# Altium schematic sheet INA219_Rsense.SchDoc
size A4; SheetNumber: 2; SheetTotal: 2
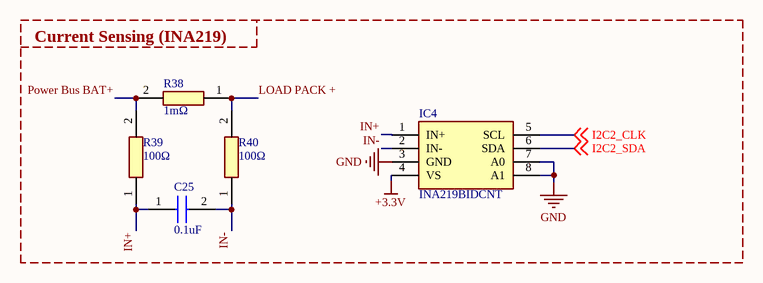
[diagram p0: INA219_Rsense.SchDoc]

## Parts
C25  0.1uF  [CAPC3216X180N]
IC4  INA219BIDCNT  [SOT65P280X145-8N]
R38  1mΩ  [RESC1608X55N]
R39  100Ω  [RESC1608X55N]
R40  100Ω  [RESC1608X55N]

## Blocks framed on the sheet
Current Sensing (INA219): C25 IC4 R38-R40

## Nets
+3.3V: IC4.4(VS)
GND: IC4.3(GND) IC4.7(A0) IC4.8(A1)
I2C2_CLK: IC4.5(SCL) ; off-sheet I2C2_CLK
I2C2_SDA: IC4.6(SDA) ; off-sheet I2C2_SDA
IN+: C25.1 IC4.1(IN+) R39.1
IN-: C25.2 IC4.2(IN-) R40.1
LOAD PACK +: R38.1 R40.2
Power Bus BAT+: R38.2 R39.2

## Notes on the sheet
- (near IC4) INA219 High Side DC Current Sensor Breakout Board - 26V ± 3.2A Max Specifications
  0.1 ohm 1% 2W current sensing resistance
  Target voltage up to + 26V
  Current measurement up to ± 3.2A with ± 0.8mA resolution
  0,9 "x 0,8" PCB
  PCB (excluding header or terminal block): 1.9g
  Note: The terminal block supplied with your product may be blue or black.
  This board / chip uses I2C 7 bit addresses 0x40, 0x41, 0x44, 0x45, which can be selected with jumper wires.

## Library data of the parts
C25 = GRM31CD80J107MEA8L: Capacitor; Manufacturer_Name: Murata Electronics; Height: 1.8mm; Manufacturer_Part_Number: GRM31CD80J107MEA8L; Mouser Part Number: 81-GRM31CD80J107MA8L; Mouser Price/Stock: https://www.mouser.co.uk/ProductDetail/Murata-Electronics/GRM31CD80J107MEA8L?qs=DPoM0jnrROWnWfPYsqocbw%3D%3D
IC4 = INA219BIDCNT: Integrated Circuit; Manufacturer_Name: Texas Instruments; Datasheet Link: http://www.ti.com/lit/ds/symlink/ina219.pdf; Height: 1.45mm; Manufacturer_Part_Number: INA219BIDCNT; Mouser Part Number: 595-INA219BIDCNT; Mouser Price/Stock: https://www.mouser.co.uk/ProductDetail/Texas-Instruments/INA219BIDCNT?qs=1WmUhT%2FVMIMmEKxVjzYikA%3D%3D; Arrow Part Number: INA219BIDCNT; Arrow Price/Stock: https://www.arrow.com/en/products/ina219bidcnt/texas-instruments?region=nac
R38-R40 = CRG0603F470R: Resistor; Manufacturer_Name: TE Connectivity; Datasheet Link: https://datasheet.datasheetarchive.com/originals/distributors/DKDS-21/401698.pdf; Height: 0.55mm; Manufacturer_Part_Number: CRG0603F470R; Mouser Part Number: 279-CRG0603F470R; Mouser Price/Stock: https://www.mouser.co.uk/ProductDetail/TE-Connectivity-Holsworthy/CRG0603F470R?qs=VHcS2MTj4gZ9vO%2FWGoSTFA%3D%3D; Arrow Part Number: CRG0603F470R; Arrow Price/Stock: https://www.arrow.com/en/products/crg0603f470r/te-connectivity?region=nac